# Altium schematic sheet SYN6288Pcb.SchDoc
size A4
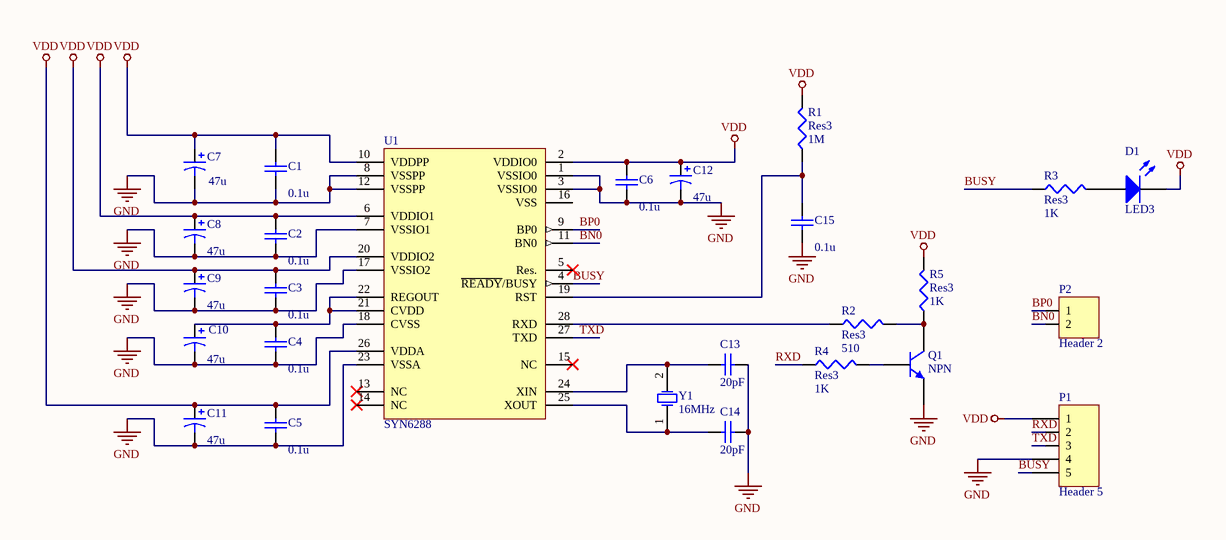
[diagram p0: SYN6288Pcb.SchDoc]

## Parts
C1  value 0.1u  [C1206]  (hidden comment: Cap Semi)
C2  value 0.1u  [C1206]  (hidden comment: Cap Semi)
C3  value 0.1u  [C1206]  (hidden comment: Cap Semi)
C4  value 0.1u  [C1206]  (hidden comment: Cap Semi)
C5  value 0.1u  [C1206]  (hidden comment: Cap Semi)
C6  value 0.1u  [C1206]  (hidden comment: Cap Semi)
C7  value 47u  [C0805]  (hidden comment: Cap Pol3)
C8  value 47u  [C0805]  (hidden comment: Cap Pol3)
C9  value 47u  [C0805]  (hidden comment: Cap Pol3)
C10  value 47u  [C0805]  (hidden comment: Cap Pol3)
C11  value 47u  [C0805]  (hidden comment: Cap Pol3)
C12  value 47u  [C0805]  (hidden comment: Cap Pol3)
C13  value 20pF  [C1206]  (hidden comment: Cap Semi)
C14  value 20pF  [C1206]  (hidden comment: Cap Semi)
C15  value 0.1u  [C1206]  (hidden comment: Cap Semi)
D1  LED3  [3.5X2.8X1.9]
P1  Header 5  [HDR1X5]
P2  Header 2  [HDR1X2]
Q1  NPN  [TO-226-AA]
R1  Res3  value 1M  [J1-0603]
R2  Res3  value 510  [J1-0603]
R3  Res3  value 1K  [J1-0603]
R4  Res3  value 1K  [J1-0603]
R5  Res3  value 1K  [J1-0603]
U1  SYN6288  [SYN6288]
Y1  16MHz  [R38]

## Nets
GND: C1.1 C2.1 C3.1 C4.1 C5.1 C6.1 C7.2 C8.2 C9.2 C10.2 C11.2 C12.2 C13.2 C14.2 C15.1 P1.4 Q1.3(E) U1.1(VSSIO0) U1.3(VSSIO0) U1.7(VSSIO1) U1.8(VSSPP) U1.12(VSSPP) U1.17(VSSIO2) U1.18(CVSS) U1.23(VSSA)
VDD: C1.2 C2.2 C3.2 C5.2 C6.2 C7.1 C8.1 C9.1 C11.1 C12.1 D1.2(K) P1.1 R1.2 R5.2 U1.2(VDDIO0) U1.6(VDDIO1) U1.10(VDDPP) U1.20(VDDIO2) U1.26(VDDA)
BN0: P2.2 U1.11(BN0)
BP0: P2.1 U1.9(BP0)
BUSY: P1.5 R3.1 U1.4(~{READY}/BUSY)
RXD: P1.2 R4.1
TXD: P1.3 U1.27(TXD)
NetC4_2: C4.2 C10.1 U1.21(CVDD) U1.22(REGOUT)
NetC13_1: C13.1 U1.24(XIN) Y1.2(OSC2)
NetC14_1: C14.1 U1.25(XOUT) Y1.1(OSC1)
NetC15_2: C15.2 R1.1 U1.19(RST)
NetD1_1: D1.1(A) R3.2
NetQ1_1: Q1.1(C) R2.2 R5.1
NetQ1_2: Q1.2(B) R4.2
NetR2_1: R2.1 U1.28(RXD)

Not connected (* = marked no-connect by the designer): U1 5(Res.)* 13(NC)* 14(NC)* 15(NC)* 16(VSS)

## Library data of the parts
C1-C6 C13-C15 = Cap Semi: Capacitor (Semiconductor SIM Model); Published: 8-Jun-2000; LatestRevisionDate: 29-May-2009; LatestRevisionNote: IPC-7351 Footprint Added.; PackageReference: C1206; Publisher: Altium Limited; PackageDescription: Chip Capacitor
C7-C12 = Cap Pol3: Polarized Capacitor (Surface Mount); Published: 8-Jun-2000; LatestRevisionDate: 29-May-2009; LatestRevisionNote: IPC-7351 Footprint Added.; PackageReference: C0805; Publisher: Altium Limited; PackageDescription: Chip Capacitor
D1 = LED3: Typical BLUE SiC LED; Published: 8-Jun-2000; LatestRevisionDate: 17-Dec-2003; LatestRevisionNote: PCB Footprint replaced.; DatasheetVersion: 16-Apr-2002; PackageVersion: 16-Apr-2002; PackageReference: 3.5X2.8X1.9; Publisher: Altium Limited; PackageDescription: SM LED; 2 C-Bend Leads; Body 3.5 x 2.8 x 1.9 mm, inc leads (LxWxH typ)
P1 = Header 5: Header, 5-Pin; LatestRevisionDate: 17-Jul-2002; LatestRevisionNote: Re-released for DXP Platform.; Publisher: Altium Limited
P2 = Header 2: Header, 2-Pin; LatestRevisionDate: 17-Jul-2002; LatestRevisionNote: Re-released for DXP Platform.; Publisher: Altium Limited
Q1 = NPN: NPN Bipolar Transistor; Published: 8-Jun-2000; LatestRevisionDate: 17-Jul-2002; LatestRevisionNote: Re-released for DXP Platform.; PackageReference: TO-226-AA; Publisher: Altium Limited; PackageDescription: TO, Flat Index; 3 In-Line, Axial Leads; Body Dia. 4.8mm; Leads 0.55 x 0.51 mm (max); Code_JEDEC: TO-226-AA
R1-R5 = Res3: Resistor; Published: 8-Jun-2000; LatestRevisionDate: 29-May-2009; LatestRevisionNote: IPC-7351 Footprint Added.; PackageReference: J1-0603; Publisher: Altium Limited; PackageDescription: Chip Resistor
Y1 = XTAL: Crystal Oscillator; Published: 8-Jun-2000; LatestRevisionDate: 17-Jul-2002; LatestRevisionNote: Re-released for DXP Platform.; PackageReference: R38; Publisher: Altium Limited; PackageDescription: Crystal, Thru-Hole; 2 Leads; Body 3.1 x 8.2 mm (Dia.xH)